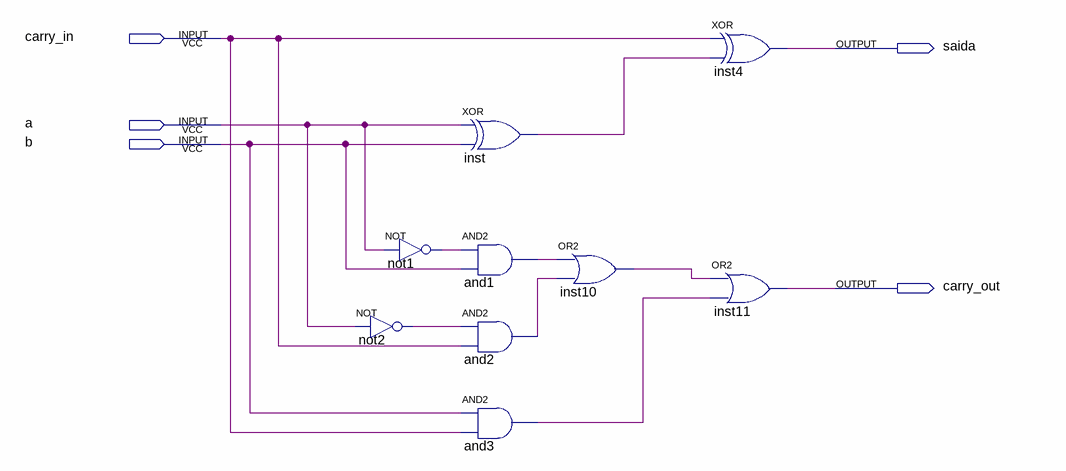
[diagram p0: schematic sheet]
// Quartus schematic subAmenosB.bdf as structural Verilog: 9 symbols, 5 pins
module subAmenosB (
  input  carry_in,
  input  a,
  input  b,
  output saida,
  output carry_out
);

  wire and1_out, and2_out, and3_out, inst10_out, inst_out, not1_out, not2_out;

  not not1 (not1_out, a);
  not not2 (not2_out, a);
  xor inst (inst_out, a, b);
  and and1 (and1_out, not1_out, b);
  and and2 (and2_out, not2_out, carry_in);
  and and3 (and3_out, b, carry_in);
  or inst10 (inst10_out, and1_out, and2_out);
  xor inst4 (saida, carry_in, inst_out);
  or inst11 (carry_out, inst10_out, and3_out);
endmodule
